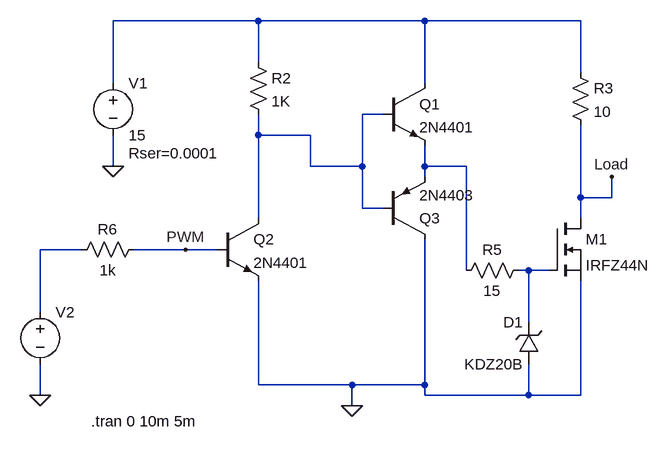
[diagram p0: schematic Low_Side_N_Channel_Driver.asc]
Low_Side_N_Channel_Driver.asc, the LTspice schematic file:
Version 4
SHEET 1 880 680
WIRE 32 0 -192 0
WIRE 288 0 32 0
WIRE 528 0 288 0
WIRE 32 64 32 0
WIRE 528 80 528 0
WIRE -192 96 -192 0
WIRE 288 96 288 0
WIRE 224 144 192 144
WIRE 32 176 32 144
WIRE 112 176 32 176
WIRE -192 224 -192 176
WIRE 112 224 112 176
WIRE 192 224 192 144
WIRE 192 224 112 224
WIRE 288 224 288 192
WIRE 352 224 288 224
WIRE 288 240 288 224
WIRE 528 272 528 160
WIRE 576 272 576 240
WIRE 576 272 528 272
WIRE 192 288 192 224
WIRE 224 288 192 288
WIRE 32 304 32 176
WIRE 528 304 528 272
WIRE -240 352 -304 352
WIRE -80 352 -160 352
WIRE -32 352 -80 352
WIRE 352 384 352 224
WIRE 448 384 432 384
WIRE 480 384 448 384
WIRE -304 448 -304 352
WIRE 448 464 448 384
WIRE 32 560 32 400
WIRE 176 560 32 560
WIRE 288 560 288 336
WIRE 288 560 176 560
WIRE -304 576 -304 528
WIRE 288 576 288 560
WIRE 448 576 448 528
WIRE 448 576 288 576
WIRE 528 576 528 400
WIRE 528 576 448 576
WIRE 176 592 176 560
FLAG 176 592 0
FLAG -192 224 0
FLAG -304 576 0
FLAG 576 240 Load
FLAG -80 352 PWM
SYMBOL npn 224 96 R0
SYMATTR InstName Q1
SYMATTR Value 2N4401
SYMBOL npn -32 304 R0
SYMATTR InstName Q2
SYMATTR Value 2N4401
SYMBOL pnp 224 336 M180
SYMATTR InstName Q3
SYMATTR Value 2N4403
SYMBOL res 16 48 R0
SYMATTR InstName R2
SYMATTR Value 1K
SYMBOL voltage -192 80 R0
WINDOW 123 0 0 Left 2
WINDOW 39 24 124 Left 2
SYMATTR InstName V1
SYMATTR Value 15
SYMATTR SpiceLine Rser=0.0001
SYMBOL voltage -304 432 R0
WINDOW 3 24 96 Invisible 2
WINDOW 123 0 0 Left 2
WINDOW 39 0 0 Left 2
SYMATTR InstName V2
SYMATTR Value PULSE(0 3.3 0 10n 10n 2u 4u)
SYMBOL nmos 480 304 R0
SYMATTR InstName M1
SYMATTR Value IRFZ44N
SYMBOL res 512 64 R0
SYMATTR InstName R3
SYMATTR Value 10
SYMBOL res 448 368 R90
WINDOW 0 0 56 VBottom 2
WINDOW 3 32 56 VTop 2
SYMATTR InstName R5
SYMATTR Value 15
SYMBOL zener 464 528 R180
WINDOW 0 24 64 Left 2
WINDOW 3 24 0 Left 2
SYMATTR InstName D1
SYMATTR Value KDZ20B
SYMBOL res -144 336 R90
WINDOW 0 0 56 VBottom 2
WINDOW 3 32 56 VTop 2
SYMATTR InstName R6
SYMATTR Value 1k
TEXT -226 616 Left 2 !.tran 0 10m 5m

The netlist it stands for:
* Low_Side_N_Channel_Driver.asc
Q1 N001 N002 N003 0 2N4401
Q2 N002 PWM 0 0 2N4401
Q3 0 N002 N003 0 2N4403
R2 N001 N002 1K
V1 N001 0 15 Rser=0.0001
V2 N004 0 PULSE(0 3.3 0 10n 10n 2u 4u)
M1 Load N005 0 0 IRFZ44N
R3 N001 Load 10
R5 N005 N003 15
D1 0 N005 KDZ20B
R6 PWM N004 1k
.model D D
.lib standard.dio
.model NPN NPN
.model PNP PNP
.lib standard.bjt
.model NMOS NMOS
.model PMOS PMOS
.lib standard.mos
.tran 0 10m 5m
.backanno
.end